# Altium schematic sheet Sheet6.SchDoc
size A4
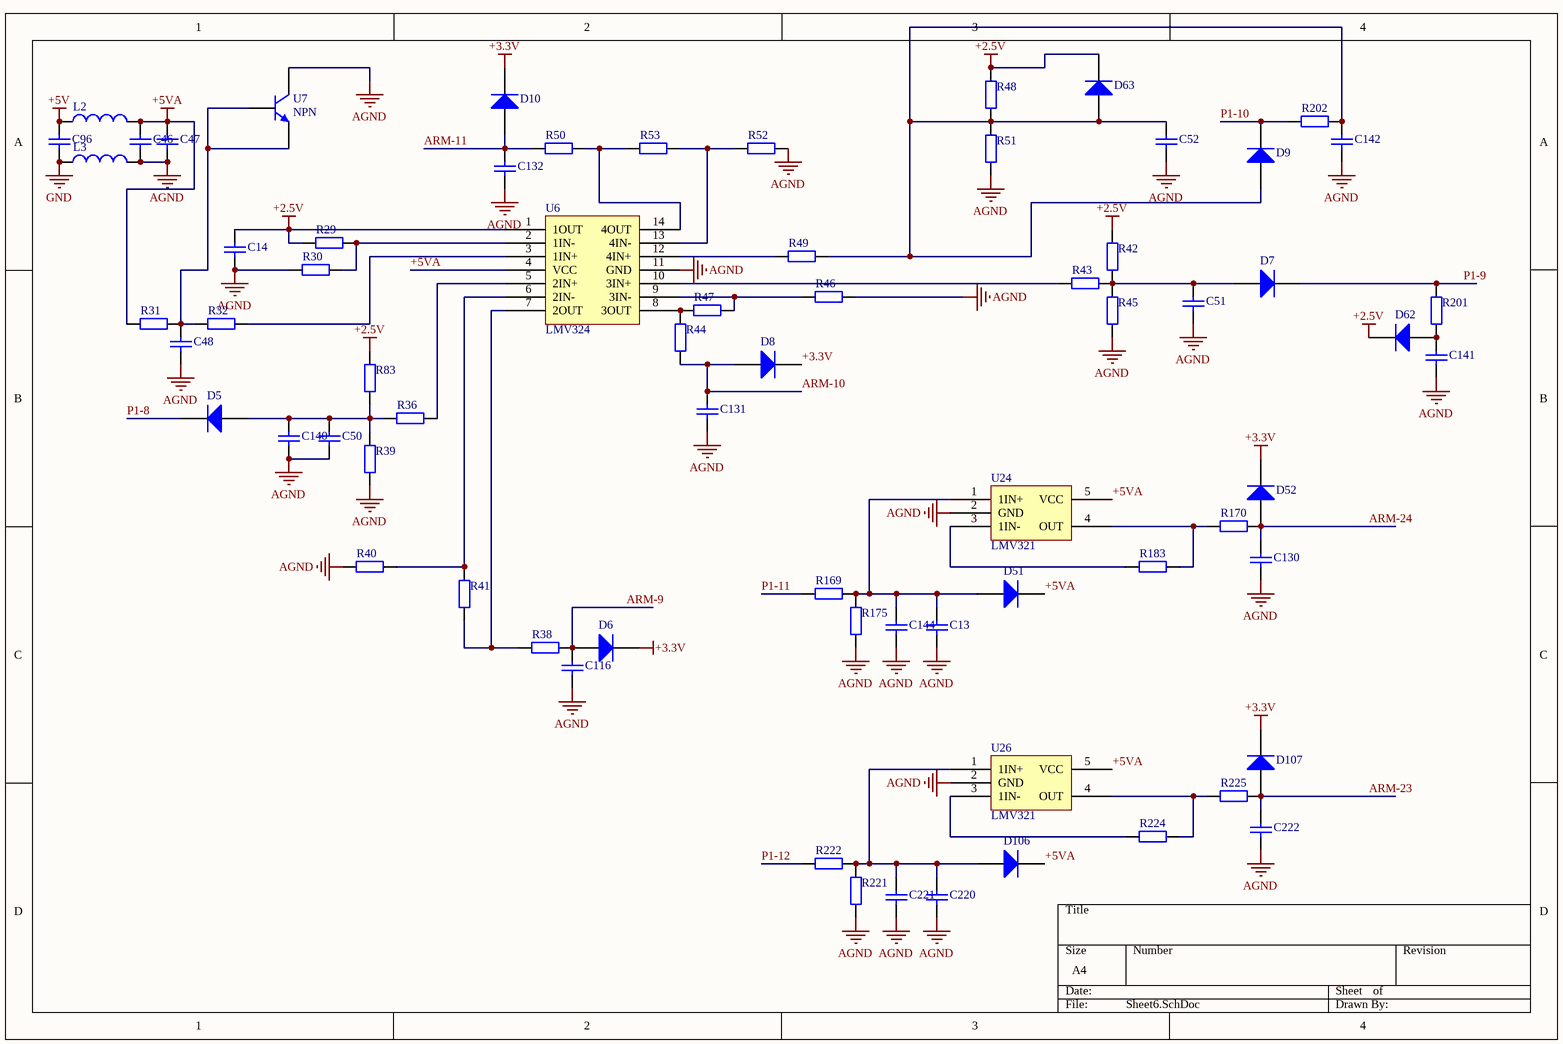
[diagram p0: Sheet6.SchDoc]

## Parts
C13  Cap  [RAD-0.3]  (value not drawn)
C14  Cap  [RAD-0.3]  (value not drawn)
C46  Cap  [RAD-0.3]  (value not drawn)
C47  Cap  [RAD-0.3]  (value not drawn)
C48  Cap  [RAD-0.3]  (value not drawn)
C50  Cap  [RAD-0.3]  (value not drawn)
C51  Cap  [RAD-0.3]  (value not drawn)
C52  Cap  [RAD-0.3]  (value not drawn)
C96  Cap  [RAD-0.3]  (value not drawn)
C116  Cap  [RAD-0.3]  (value not drawn)
C130  Cap  [RAD-0.3]  (value not drawn)
C131  Cap  [RAD-0.3]  (value not drawn)
C132  Cap  [RAD-0.3]  (value not drawn)
C140  Cap  [RAD-0.3]  (value not drawn)
C141  Cap  [RAD-0.3]  (value not drawn)
C142  Cap  [RAD-0.3]  (value not drawn)
C144  Cap  [RAD-0.3]  (value not drawn)
C220  Cap  [RAD-0.3]  (value not drawn)
C221  Cap  [RAD-0.3]  (value not drawn)
C222  Cap  [RAD-0.3]  (value not drawn)
D5  Diode 1N4007  [DO-41]  (value not drawn)
D6  Diode 1N4007  [DO-41]  (value not drawn)
D7  Diode 1N4007  [DO-41]  (value not drawn)
D8  Diode 1N4007  [DO-41]  (value not drawn)
D9  Diode 1N4007  [DO-41]  (value not drawn)
D10  Diode 1N4007  [DO-41]  (value not drawn)
D51  Diode 1N4007  [DO-41]  (value not drawn)
D52  Diode 1N4007  [DO-41]  (value not drawn)
D62  Diode 1N4007  [DO-41]  (value not drawn)
D63  Diode 1N4007  [DO-41]  (value not drawn)
D106  Diode 1N4007  [DO-41]  (value not drawn)
D107  Diode 1N4007  [DO-41]  (value not drawn)
L2  Inductor  [0402-A]  (value not drawn)
L3  Inductor  [0402-A]  (value not drawn)
R29  Res2  [AXIAL-0.4]  (value not drawn)
R30  Res2  [AXIAL-0.4]  (value not drawn)
R31  Res2  [AXIAL-0.4]  (value not drawn)
R32  Res2  [AXIAL-0.4]  (value not drawn)
R36  Res2  [AXIAL-0.4]  (value not drawn)
R38  Res2  [AXIAL-0.4]  (value not drawn)
R39  Res2  [AXIAL-0.4]  (value not drawn)
R40  Res2  [AXIAL-0.4]  (value not drawn)
R41  Res2  [AXIAL-0.4]  (value not drawn)
R42  Res2  [AXIAL-0.4]  (value not drawn)
R43  Res2  [AXIAL-0.4]  (value not drawn)
R44  Res2  [AXIAL-0.4]  (value not drawn)
R45  Res2  [AXIAL-0.4]  (value not drawn)
R46  Res2  [AXIAL-0.4]  (value not drawn)
R47  Res2  [AXIAL-0.4]  (value not drawn)
R48  Res2  [AXIAL-0.4]  (value not drawn)
R49  Res2  [AXIAL-0.4]  (value not drawn)
R50  Res2  [AXIAL-0.4]  (value not drawn)
R51  Res2  [AXIAL-0.4]  (value not drawn)
R52  Res2  [AXIAL-0.4]  (value not drawn)
R53  Res2  [AXIAL-0.4]  (value not drawn)
R83  Res2  [AXIAL-0.4]  (value not drawn)
R169  Res2  [AXIAL-0.4]  (value not drawn)
R170  Res2  [AXIAL-0.4]  (value not drawn)
R175  Res2  [AXIAL-0.4]  (value not drawn)
R183  Res2  [AXIAL-0.4]  (value not drawn)
R201  Res2  [AXIAL-0.4]  (value not drawn)
R202  Res2  [AXIAL-0.4]  (value not drawn)
R221  Res2  [AXIAL-0.4]  (value not drawn)
R222  Res2  [AXIAL-0.4]  (value not drawn)
R224  Res2  [AXIAL-0.4]  (value not drawn)
R225  Res2  [AXIAL-0.4]  (value not drawn)
U6  LMV324
U7  NPN  [TO-226]
U24  LMV321
U26  LMV321

## Nets
+2.5V: C14.2 D62.2(K) D63.2(K) R29.2 R42.1 R48.1 R83.1 U6.1(1OUT)
+3.3V: D6.2(K) D8.2(K) D10.2(K) D52.2(K) D107.2(K)
+5V: C96.2 L2.1
+5VA: C46.2 C47.2 D51.2(K) D106.2(K) L2.2 R31.2 U6.4(VCC) U24.5(VCC) U26.5(VCC)
AGND: C13.1 C14.1 C46.1 C47.1 C48.1 C50.1 C51.1 C52.1 C116.1 C130.1 C131.1 C132.1 C140.1 C141.1 C142.1 C144.1 C220.1 C221.1 C222.1 L3.2 R30.2 R39.2 R40.2 R45.2 R46.1 R51.2 R52.1 R175.2 R221.2 U6.11(GND) U7.1(C) U24.2(GND) U26.2(GND)
GND: C96.1 L3.1
ARM-9: C116.2 D6.1(A) R38.2
ARM-10: C131.2 D8.1(A) R44.2
ARM-11: C132.2 D10.1(A) R50.2
ARM-23: C222.2 D107.1(A) R225.1
ARM-24: C130.2 D52.1(A) R170.1
P1-8: D5.2(K)
P1-9: D7.2(K) R201.1
P1-10: D9.2(K) R202.1
P1-11: R169.2
P1-12: R222.2
NetC13_2: C13.2 C144.2 D51.1(A) R169.1 R175.1 U24.1(1IN+)
NetC48_2: C48.2 R31.1 R32.2 U7.2(B) U7.3(E)
NetC50_2: C50.2 C140.2 D5.1(A) R36.2 R39.1 R83.2
NetC51_2: C51.2 D7.1(A) R42.2 R43.1 R45.1
NetC52_2: C52.2 C142.2 D9.1(A) D63.1(A) R48.2 R49.1 R51.1 R202.2
NetC141_2: C141.2 D62.1(A) R201.2
NetC220_2: C220.2 C221.2 D106.1(A) R221.1 R222.1 U26.1(1IN+)
NetR29_1: R29.1 R30.1 U6.2(1IN-)
NetR32_1: R32.1 U6.3(1IN+)
NetR36_1: R36.1 U6.5(2IN+)
NetR38_1: R38.1 R41.2 U6.7(2OUT)
NetR40_1: R40.1 R41.1 U6.6(2IN-)
NetR43_2: R43.2 U6.10(3IN+)
NetR44_1: R44.1 R47.2 U6.8(3OUT)
NetR46_2: R46.2 R47.1 U6.9(3IN-)
NetR49_2: R49.2 U6.12(4IN+)
NetR50_1: R50.1 R53.2 U6.14(4OUT)
NetR52_2: R52.2 R53.1 U6.13(4IN-)
NetR170_2: R170.2 R183.1 U24.4(OUT)
NetR183_2: R183.2 U24.3(1IN-)
NetR224_1: R224.1 R225.2 U26.4(OUT)
NetR224_2: R224.2 U26.3(1IN-)

## Library data of the parts
C13 C14 C46-C48 C50-C52 C96 C116 C130-C132 C140-C142 C144 C220-C222 = Cap: Capacitor; Value: 100pF; Published: 8-Jun-2000; LatestRevisionDate: 17-Jul-2002; LatestRevisionNote: Re-released for DXP Platform.; PackageReference: RAD-0.3; Publisher: Altium Limited
D5-D10 D51 D52 D62 D63 D106 D107 = Diode 1N4007: 1 Amp General Purpose Rectifier; Published: 8-Jun-2000; LatestRevisionDate: 17-Jul-2002; LatestRevisionNote: Re-released for DXP Platform.; DatasheetDocument: 1998; PackageDocument: Aug-1999; PackageReference: DO-41; Publisher: Altium Limited; Code_JEDEC: DO-204-AL; ComponentLink1Description: Manufacturer Link; ComponentLink1URL: http://www.fairchildsemi.com/; ComponentLink2Description: Datasheet; ComponentLink2URL: http://www.fairchildsemi.com/ds/1N%2F1N4001.pdf
L2 L3 = Inductor: Code_IEC: 1005; Value: 10mH; Published: 8-Jun-2000; LatestRevisionDate: 17-Jul-2002; LatestRevisionNote: Re-released for DXP Platform.; PackageReference: 0402-A; Publisher: Altium Limited; Code_JEITA: 0402
R29-R32 R36 R38-R53 R83 R169 R170 R175 R183 R201 R202 R221 R222 R224 R225 = Res2: Resistor; Value: 1K; Published: 8-Jun-2000; LatestRevisionDate: 17-Jul-2002; LatestRevisionNote: Re-released for DXP Platform.; PackageReference: AXIAL-0.4; Publisher: Altium Limited
U6 U24 U26 = Component_1
U7 = NPN: NPN Bipolar Transistor; Published: 8-Jun-2000; LatestRevisionDate: 17-Jul-2002; LatestRevisionNote: Re-released for DXP Platform.; PackageReference: TO-226; Publisher: Altium Limited; Code_JEDEC: TO-226-AA